# Altium project glucometer_board.PrjPcb
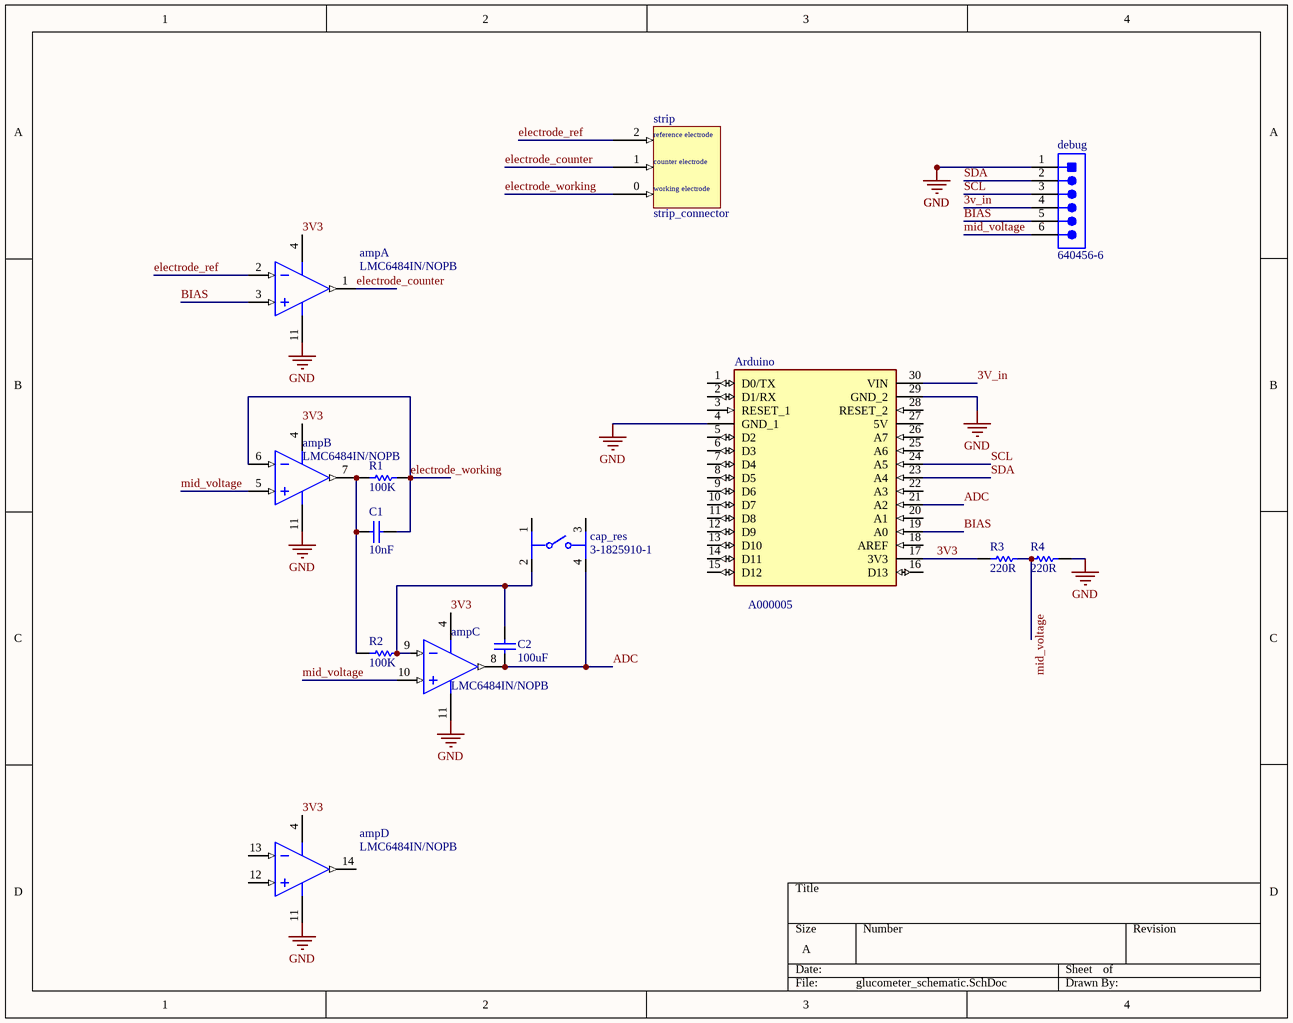
[diagram p0: glucometer_schematic.SchDoc]
1 sheet, 11 parts. Net scope: global (net labels, ports and power ports of the same name join across sheets).
Board file: glucometer_pcb.PcbDoc

## Sheet glucometer_schematic.SchDoc
size A; SheetNumber: 1; SheetTotal: 1

### Parts
amp  LMC6484IN/NOPB  [NFF0014A]  (parts A,B,C,D of 4)
Arduino  A000005  [MODULE_A000005]
C1  10nF  [KEMT-C330C105M5U5TA]
C2  100uF  [KEMT-C330C105M5U5TA]
cap_res  3-1825910-1  [FP-3-1825910-1-MFG]
debug  640456-6  [TECO-640456-6_V]
R1  100K  [RESA60-630X240]
R2  100K  [RESA60-630X240]
R3  220R  [RESA60-630X240]
R4  220R  [RESA60-630X240]
strip  strip_connector  [strip_connector]

### Nets
GND: amp.11(V-) Arduino.4(GND_1) Arduino.29(GND_2) debug.1 R4.1
3V3: amp.4(V+) Arduino.17(3V3) R3.2
3V_in: Arduino.30(VIN) debug.4
ADC: amp.8(OUT3) Arduino.21(A2) C2.1 cap_res.4
BIAS: amp.3(IN1+) Arduino.19(A0) debug.5
electrode_counter: amp.1(OUT1) strip.1(counter)
electrode_ref: amp.2(IN1-) strip.2(reference)
electrode_working: amp.6(IN2-) C1.2 R1.2 strip.0(working)
mid_voltage: amp.5(IN2+) amp.10(IN3+) debug.6 R3.1 R4.2
SCL: Arduino.24(A5) debug.3
SDA: Arduino.23(A4) debug.2
Netamp_7: amp.7(OUT2) C1.1 R1.1 R2.1
Netamp_9: amp.9(IN3-) C2.2 cap_res.2 R2.2

Not connected (* = marked no-connect by the designer): amp 12(IN4+) 13(IN4-) 14(OUT4); Arduino 1(D0/TX) 2(D1/RX) 3(RESET_1) 5(D2) 6(D3) 7(D4) 8(D5) 9(D6) 10(D7) 11(D8) 12(D9) 13(D10) 14(D11) 15(D12) 16(D13) 18(AREF) 20(A1) 22(A3) 25(A6) 26(A7) 27(5V) 28(RESET_2); cap_res 1 3

### Notes on the sheet
- (in symbol strip_connector) reference electrode; counter electrode; working electrode

### Library data of the parts
amp = CMP-0055-00188-3: CMOS Quad Rail to Rail Input and Output Operational Amplifier, 14-pin MDIP, Pb-Free; Manufacturer: Texas Instruments; CompType: Amplifiers; PackageTopMarking: NSUZXYYTTE#*LMC6484IN; PowerWise: N; PinCount: 14; Package Reference: NFF0014A; RoHS: Y; ComponentLink1URL: http://www.ti.com/general/docs/lit/getliterature.tsp?genericPartNumber=LMC6484&fileType=pdf; PackageDescription: MDIP, .750 x .250 x.130in, 14 Lead, .100in Pitch; ComponentLink1Description: Datasheet URL; Code_JEDEC: MS-001-AA
Arduino = A000005: CLOCK SAW OSCILLATOR SEAM7050 T&; MF: Arduino; Package: None; SnapEDA_Link: https://www.snapeda.com/parts/A000005/Arduino/view-part/51027/?ref=snap; MP: A000005; Value: *; Digi-Key_Purchase_URL: https://www.digikey.com/product-detail/en/diodes-incorporated/SPA000005J/SPA000005J-ND/9769570?utm_source=snapeda&utm_medium=aggregator&utm_campaign=symbol; Digi-Key_Part_Number: SPA000005J-ND
C1 C2 = CMP-2000-06056-1: Ceramic Capacitor, 1 uF, +/- 20%, 50 V, -10 to 85 degC, 2-Pin THD, RoHS, Bulk; Manufacturer: Kemet; Voltage - Rated: 50V; Temperature Coefficient: Z5U; Catalog Drawings: C330(std); Product Training Modules: CapacitorBasics-TypicalUsesforCapacitors; Capacitance: 1µF; Online Catalog: GoldenMax™Series; Other Names: 399-4390; PCN Design/Specification: C3yySeriesGoldenMaxLeadConfiguration02/Feb/2015; Thickness (Max): -; Size / Dimension: 0.300"Lx0.150"W(7.62mmx3.81mm); Mounting Technology: ThroughHole; Tolerance: ±20%; Mounting Type: ThroughHole; Datasheet URL: http://www.kemet.com/Lists/ProductCatalog/Attachments/599/KEM_C1051_GOLDMAX_Z5U.pdf; Series: GoldenMax™; Standard Package: 250; Ratings: -; Applications: GeneralPurpose; Package Reference: C330C105M5U5TA; Packaging: Bulk; Category: Capacitors; Package Description: 2-Pin Through Hole Device, Body 7.11 x 4.07 mm; Operating Temperature: 10°C~85°C; Height - Seated (Max): 0.360"(9.14mm); Manufacturer URL: http://www.kemet.com/; Lead Spacing: 0.200"(5.08mm); Features: -; Lead Style: Straight; Package / Case: Radial; Family: CeramicCapacitors; Datasheet Version: 12/2015
cap_res = CMP-03407-000001-1: SWITCH TACTILE SPST-NO 0.05A 24V; Manufacturer: TE Connectivity; Operating Force: 160gf; Contact Current Rating: 50mA; Description: Switch Tactile OFF (ON) SPST Round Button PC Pins 0.05A 24VDC 100000Cycles 1.57N Thru-Hole; Contact Resistance: 100mΩ; Electromechanical Life: 100000Cycles; Device Class L1: Electromechanical; ComponentLink2URL: https://www.te.com/commerce/DocumentDelivery/DDEController?Action=srchrtrv&DocNm=1825910&DocType=Customer+Drawing&DocLang=English; Category: Switch; Device Class L2: Switches; Temperature: -35°C to +85°C; RoHS: TRUE; Mount: Through Hole; Manufacturer Part Number: 3-1825910-1; Automotive: No; Lead Free: Yes; Device Class L3: Tactile Switches; ComponentLink2Description: Datasheet; Temperature Range High: +85°C; Height: 17.3mm; Package: 0; Temperature Range Low: -35°C; Throw Configuration: SPST-NO; Digikey Description: SWITCH TACTILE SPST-NO 0.05A 24V; Octopart: https://octopart.com/3-1825910-1-te+connectivity-46506874
debug = CMP-2000-05661-1: Male Header, Pitch 2.54 mm, 1 x 6 Position, Height 10.03 mm, Tail Length 3.56 mm, -55 to 105 degC, Bulk; Manufacturer: TE Connectivity; Contact Centerline Spacing: 0.100 / in.; Number of Contacts: 6; Current, Rating: 5 / A; Agency Approvals: CSA,UL; Material, Contact: CopperAlloy; Mounting Hole Size: 0.04 / "; Brand/Series: MTA-100Series; Pin Spacing: 0.1 / "; Mount Angle: Vertical; Contact Termination Area Plating: Tin; Angle: Straight; Primary Type: InterconnectSystem; Standards: RoHSCompliant,ELVCompliant,UL94V-0; Temperature, Operating: -55to+105 / °C; Material, Housing: Polyester; Special Features: Pinstrip; Color, Housing: White; Connector Type: MTA-100; Voltage, Rating: 250 / V; Termination: Solder; Package Reference: 640456-6; Size, Post: 0.025 / in.; Color: White; Datasheet URL: https://datasheet.ciiva.com/25618/0900766b80eb7fdd-25618163.pdf; Manufacturer URL: http://www.te.com/; Mounting Type: PCMount; Length, Pin: 0.14 / "; Type: PCBPlug; Length, Overall: 0.6 / "; Mounting Technology: ThroughHole; Number of Rows: 1; Contact Shape: Square; Contact Mating Area Plating: Tin; Datasheet Version: Rev. W, 05/2005; Number of Positions: 6; Package Description: Male Header, Pitch 2.54 mm, 1 x 6 Position, Height 10.03 mm, Tail Length 3.56 mm; Contact Plating: Tin; Length, Terminal Post: 0.14 / in.; Flammability Rating: UL94V-0
R1-R4 = CMP-1659-00065-1: Axial Resistor, 2.21 KOhm, +/- 1%, 0.25 W, -55 to 155 degC, 2-Pin THD, RoHS, Bulk; Case\Package: 0402; Current Rating: 300 mA; Shielding: Unshielded; Resistance: 0.15 Ohm; Radiation Hardening: No; Mount: Surface Mount; REACH SVHC: No SVHC; Height: 0.02 inch; ComponentLink1URL: http://www.yageo.com/; Case Code (Imperial): 0402; ComponentLink2Description: Datasheet; ComponentLink1Description: Manufacturer URL; Max Operating Temperature: 125 degC; DatasheetVersion: Apr-13; PackageReference: MFR-25; RoHSCompliant: true; PackageDescription: 2-Pin Axial Lead, Dia 2.4 mm, Body Length 6.3 mm; ComponentLink2URL: http://www.yageo.com/documents/recent/Yageo%20LR_MFR_2013.pdf; Pins: 2; Length: 0.04 inch; Case Code (Metric): 1005; Packaging: Tape and Reel; Width: 0.02 inch; Min Operating Temperature: -55 degC; Package Quantity: 10000